# EAGLE design usb-485 (EAGLE 6.1)
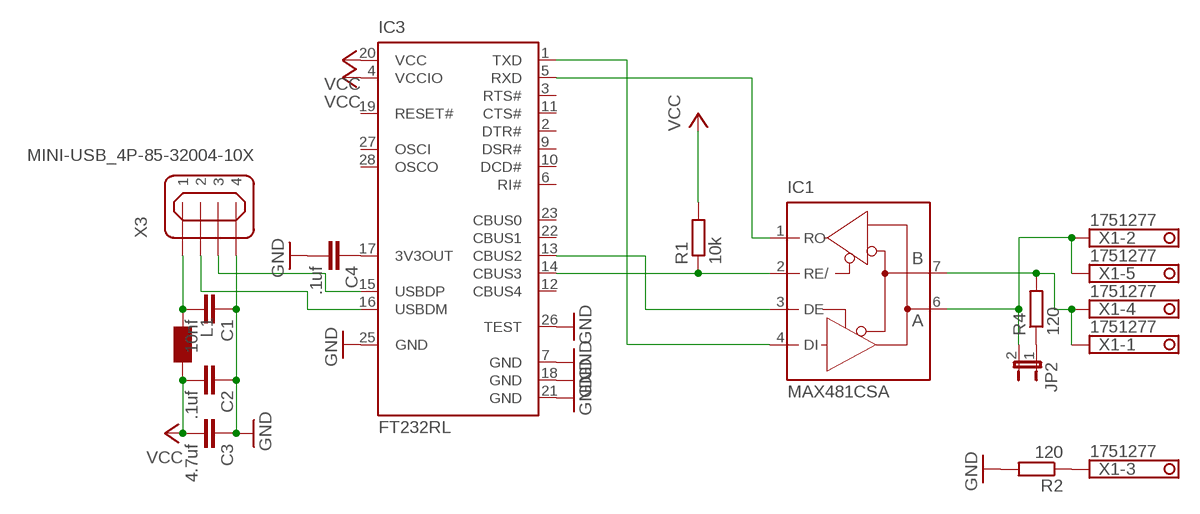
[diagram p0: schematic, sheet 1]

## Parts
C1  10nf  C-EUC0805  [C0805]
C2  .1uf  C-EUC1206  [C1206]
C3  4.7uf  C-EUC1206  [C1206]
C4  .1uf  C-EUC1206  [C1206]
IC1  MAX481CSA  [SO08]
IC3  FT232RL  [SSOP28]
JP2  JP1E  [JP1]
L1  WE-CBF_1206  [1206]
R1  10k  R-EU_0207/10  [0207/10]
R2  120  R-EU_0207/10  [0207/10]
R4  120  R-EU_0207/10  [0207/10]
X1  1751277  [1751277]
X3  MINI-USB_4P-85-32004-10X  [85-32004-10X]

## Nets
GND: C1.1 C2.1 C3.1 C4.2 IC3.7(GND) IC3.18(GND) IC3.21(GND) IC3.25(GND) IC3.26(TEST) R2.2 X3.4
N$1: IC1.3(DE) IC3.13(CBUS2)
N$2: IC1.2(RE/) IC3.14(CBUS3) R1.1
N$3: IC1.7(B) R4.2 X1.1 X1.4
N$4: R2.1 X1.3
N$5: JP2.1 R4.1
N$7: C1.2 L1.1 X3.1
N$8: IC1.6(A) JP2.2 X1.2 X1.5
N$15: IC3.16(USBDM) X3.2
N$16: IC3.15(USBDP) X3.3
N$17: C4.1 IC3.17(3V3OUT)
N$21: IC1.1(RO) IC3.5(RXD)
N$23: IC1.4(DI) IC3.1(TXD)
VCC: C2.2 C3.2 IC3.4(VCCIO) IC3.20(VCC) L1.2 R1.2
Unconnected: IC3.2(DTR#) IC3.3(RTS#) IC3.6(RI#) IC3.9(DSR#) IC3.10(DCD#) IC3.11(CTS#) IC3.12(CBUS4) IC3.19(RESET#) IC3.22(CBUS1) IC3.23(CBUS0) IC3.27(OSCI) IC3.28(OSCO)

## Power pins joined to a net without a drawn wire
GND: IC1.5(GND)
VCC: IC1.8(VCC)

## Library data of the parts
C1-C4 = rcl:C-EU: CAPACITOR, European symbol
IC1 = maxim:MAX481CSA: RS485 TRANSEIVER; MF: MAXIM; MPN: MAX481CSA; OC_FARNELL: unknown; OC_NEWARK: 90C3817
IC3 = ftdichip:FT232R: Source: http://www.ftdichip.com/Documents/DataSheets/DS_FT232R_v104.pdf
JP2 = jumper:JP1E: JUMPER
L1 = wuerth-elektronik:WE-CBF: SMD EMI Suppression Ferrite Beads - excellent anti-EMI properties - low DCR - impedances till 3000 ohms - rated current up to 6 A
R1 R2 R4 = rcl:R-EU_: RESISTOR, European symbol
X1 = con-phoenix-350:1751277: MKDS 1/ 5-3,5 Printklemme Nennstrom: 10 A Bemessungsspannung: 160 V Raster: 3,5 mm Polzahl: 5 Montageart: Löten Anschlussart: Schraubanschluss Anschlussrichtung vom Leiter zur Platine: 0° Source: http://eshop.phoenixcontact.com .. 1751277.pdf; OC_FARNELL: unknown; OC_NEWARK: unknown
X3 = con-cypressindustries:MINI-USB_4P-: MINI USB 4 Pol. Source: www.cypressindustries.com

## Board
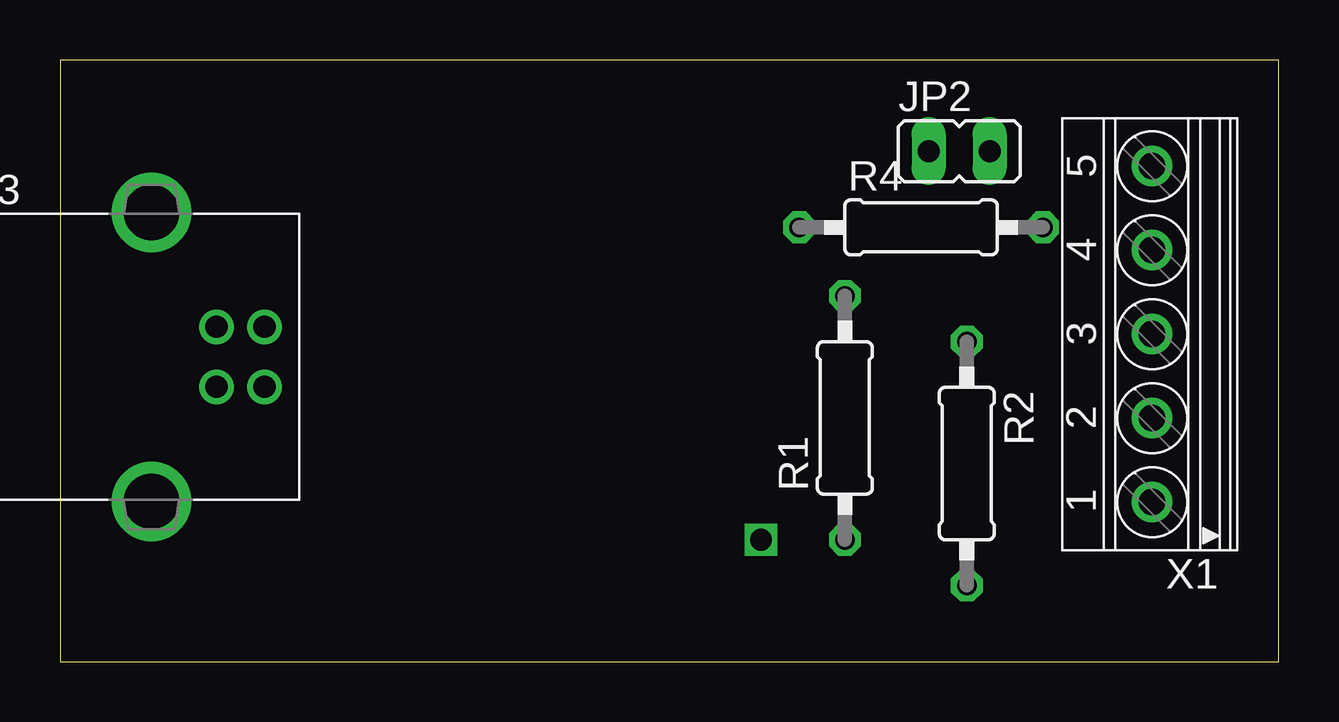
[diagram p1: board, top side]
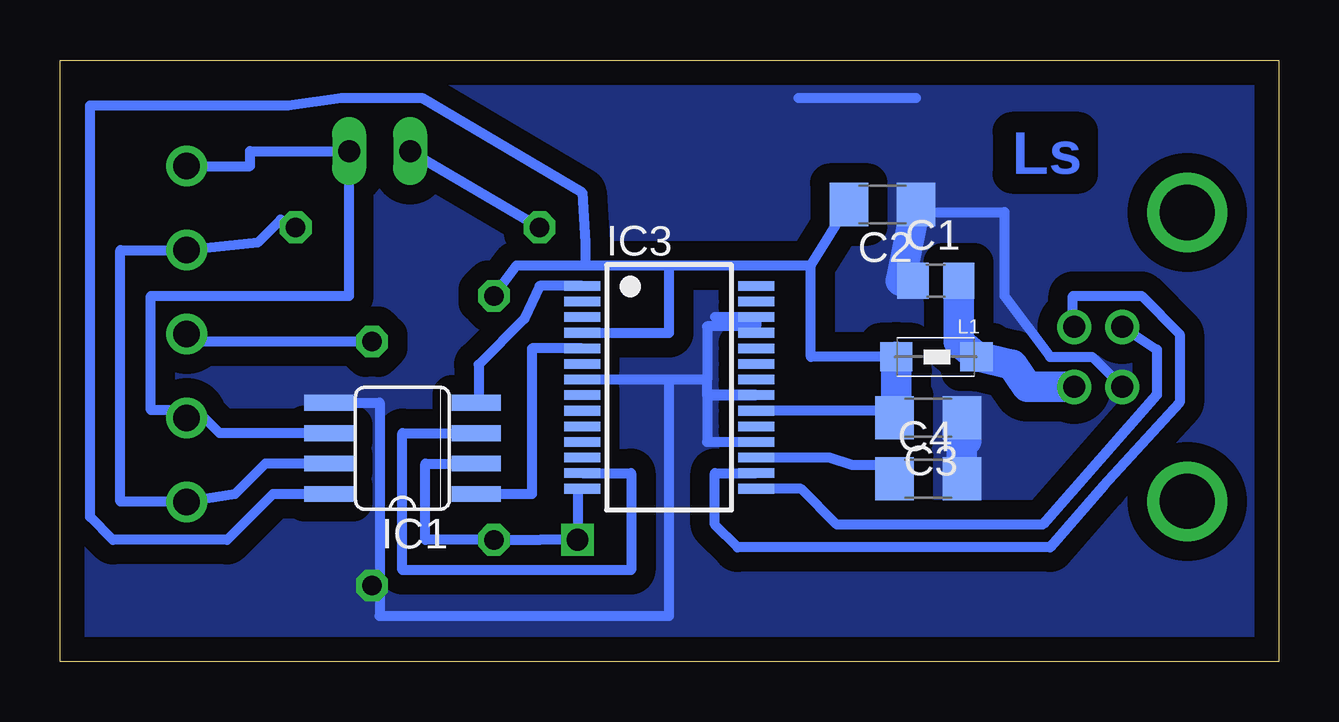
[diagram p2: board, bottom side, seen from below]

Size 50.78 x 25.07 mm. Coordinates in mm from the lower left corner, seen from the top.
Outline: 0,0 50.78,0 50.78,25.07 0,25.07 0,0
Copper layers (1*16): Top 0.035mm / dielectric 1.5mm / Bottom 0.035mm
Design rules: minimum track width 10mil, minimum drill 24mil, track to track 8mil, track to pad 8mil, pad to pad 8mil, via to via 8mil, smd to smd 8mil, copper to edge 40mil, drill to drill 8mil, minimum pad ring 10mil, minimum via ring 8mil, stop-mask expansion 4mil, vias tented up to drill 0mil, thermal gap 10mil

### Footprints (pad centres in the part's own frame; a part is rotated, then mirrored left to right if it is on the bottom)
C0805 = smd 1.3 x 1.5: 1 -0.95,0; 2 0.95,0
C1206 = smd 1.6 x 1.8: 1 -1.4,0; 2 1.4,0
SO08 = smd 0.66 x 2.032: 1 -1.905,-3.073; 2 -0.635,-3.073; 3 0.635,-3.073; 4 1.905,-3.073; 5 1.905,3.073; 6 0.635,3.073; 7 -0.635,3.073; 8 -1.905,3.073
SSOP28 = smd 0.4 x 1.5: 1 -4.225,-3.625; 2 -3.575,-3.625; 3 -2.925,-3.625; 4 -2.275,-3.625; 5 -1.625,-3.625; 6 -0.975,-3.625; 7 -0.325,-3.625; 8 0.325,-3.625; 9 0.975,-3.625; 10 1.625,-3.625; 11 2.275,-3.625; 12 2.925,-3.625; 13 3.575,-3.625; 14 4.225,-3.625; 15 4.225,3.625; 16 3.575,3.625; 17 2.925,3.625; 18 2.275,3.625; 19 1.625,3.625; 20 0.975,3.625; 21 0.325,3.625; 22 -0.325,3.625; 23 -0.975,3.625; 24 -1.625,3.625; 25 -2.275,3.625; 26 -2.925,3.625; 27 -3.575,3.625; 28 -4.225,3.625
JP1 = drill 0.914 long: 1 0,-1.27; 2 0,1.27
1206 = smd 1.35 x 1.2: 1 -1.7,0; 2 1.65,0
0207/10 = drill 0.813 octagon: 1 -5.08,0; 2 5.08,0
1751277 = drill 1.1 pad 1.7: 1 -7,-0.1; 2 -3.5,-0.1; 3 0,-0.1; 4 3.5,-0.1; 5 7,-0.1
85-32004-10X = drill 0.92 pad 1.27: 1 4.71,-1.25; 2 4.71,1.25; 3 2.71,1.25; 4 2.71,-1.25 | drill 2.3 pad 3: M1 0,6.02; M2 0,-6.02

### Placement (x,y rotation side)
C1  14.29,15.88 0 bottom
C2  16.51,19.05 180 bottom
C3  14.61,10.16 180 bottom
C4  14.61,7.62 0 bottom
IC1  36.51,8.89 90 bottom
IC3  25.4,11.43 270 bottom
JP2  37.47,21.27 270 top
L1  14.29,12.7 180 bottom
R1  32.7,10.16 90 top
R2  37.78,8.26 270 top
R4  35.88,18.1 0 top
X1  45.4,13.65 90 top
X3  3.81,12.7 0 top

### Tracks (layer width: path | path; a pad name or v marks a point on that pad's centre or on a via)
GND
  Bottom 0.406: 15.24,16.19 C1.1 15.24,19.37 14.92,19.37 14.92,18.73 11.43,18.73 11.43,15.24 9.53,12.7 7.77,12.7 X3.4 | 21.77,13.97 IC3.26 23.5,14.36 | IC3.25 21.77,13.97 | 21.77,13.97 23.81,13.97 23.81,11.76 | 23.81,11.11 | 23.81,11.11 IC3.21 23.81,11.11 | 23.81,11.11 23.81,9.15 IC3.18 | 23.81,11.11 23.81,11.76 | 23.81,11.76 25.4,11.76 | 25.4,11.76 IC3.7 | 20,23.5 15.11,23.5 | IC1.5 37.47,10.79 37.47,1.91 25.4,1.91 25.4,11.76
  Bottom 1.27: C4.2 C3.1 13.02,9.21 | C1.1 15.74,15.88 C2.1
  pour Bottom (isolate 0.813, no thermals): 0,25.08 50.8,25.08 50.8,0 0,0
N$1
  Bottom 0.406: IC3.13 26.99,7.86 26.99,3.81 36.51,3.81 36.51,9.53 IC1.3
N$2  (via drill 0.9)
  Bottom 0.406: IC3.14 29.21,7.21 v29.21,5.08 30.8,5.08 R1.1 35.56,5.08 35.56,8.26 IC1.2
N$3
  Bottom 0.406: IC1.7 42.23,8.26 43.5,6.99 45.49,6.67 | 45.49,6.67 X1.1 | R4.2 41.59,18.41 42.55,17.46 X1.4 48.26,17.14 48.26,6.67 45.49,6.67
N$4
  Bottom 0.406: R2.1 45.4,13.34 45.4,13.65 X1.3
N$5
  Bottom 0.406: JP2.1 R4.1
N$7
  Bottom 1.27: C1.2 13.34,13.34 L1.1 12.59,12.72 11.11,12.38 10.48,11.45 X3.1
N$8
  Bottom 0.406: IC1.6 44.13,9.53 45.09,10.48 45.49,10.48 | 45.49,10.48 X1.2 | 45.49,10.48 46.99,10.48 46.99,15.24 38.73,15.24 JP2.2 42.86,21.27 42.86,20.65 X1.5
N$15
  Bottom 0.406: X3.2 8.57,14 8.57,15.24 5.71,15.24 4.13,13.65 4.13,10.79 7.3,7.3 9.53,4.76 22.54,4.76 23.5,5.71 23.5,7.86 IC3.16
N$16
  Bottom 0.406: X3.3 5.08,13 5.08,11.11 9.84,5.71 18.41,5.71 19.91,7.21 IC3.15
N$17
  Bottom 0.406: C4.1 16,8.19 17.78,8.19 18.73,8.51 IC3.17
N$21
  Bottom 0.406: IC3.5 31.11,13.05 31.11,6.99 IC1.1
N$23
  Bottom 0.406: IC3.1 30.8,15.65 31.43,14.29 33.34,12.38 33.34,10.79 IC1.4
VCC
  Bottom 0.406: C3.2 16,10.46 IC3.20 | L1.2 19.5,12.7 19.5,16.51 | 19.5,16.51 C2.2 | IC3.4 25.4,13.71 25.4,16.51 | 25.4,16.51 19.5,16.51 | R1.2 31.75,16.51 28.89,16.51 | 28.89,16.51 25.4,16.51 | IC1.8 41.91,6.99 43.81,5.08 48.58,5.08 49.53,6.03 49.53,23.18 41.27,23.18 39.05,23.5 35.69,23.5 29.02,19.55 28.89,17.46 28.89,16.51
  Bottom 1.27: C3.2 15.94,11.11 L1.2

### Text on the board
Bottom: Ls